# EAGLE design ISI_experiement (EAGLE 7.2.0)
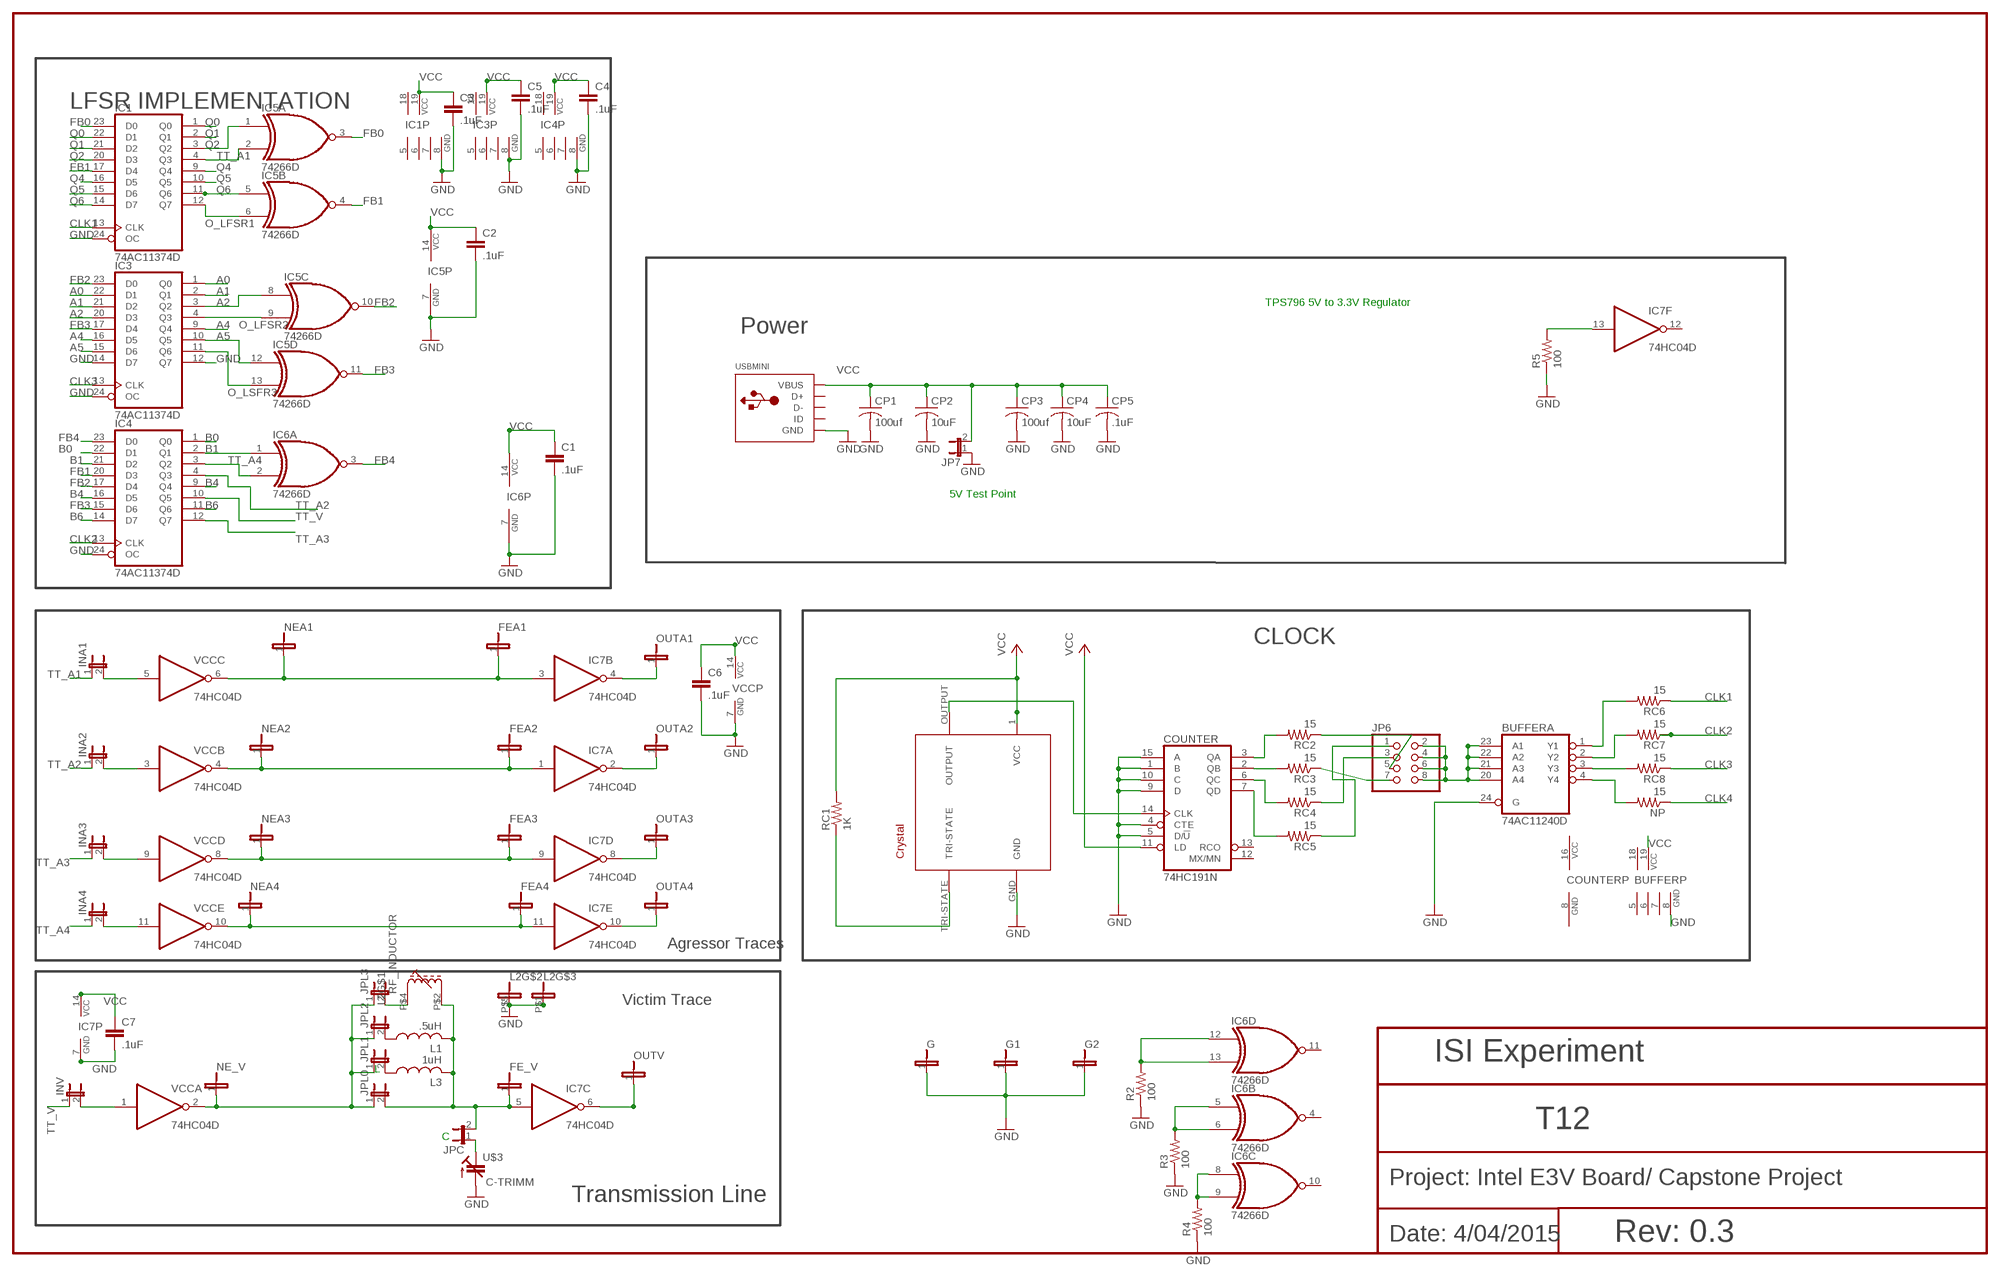
[diagram p0: schematic, sheet 1]

## Parts
BUFFER  74AC11240D  [SO24W]
C1  .1uF  C  [C0805]
C2  .1uF  C  [C0805]
C3  .1uF  C  [C0805]
C4  .1uF  C  [C0805]
C5  .1uF  C  [C0805]
C6  .1uF  C  [C0805]
C7  .1uF  C  [C0805]
COUNTER  74HC191N  [DIL16]
CP1  100uf  C-USC1206K  [C1206K]
CP2  10uF  C-USC1206K  [C1206K]
CP3  100uf  C-USC1206K  [C1206K]
CP4  10uF  C-USC1206K  [C1206K]
CP5  .1uF  C-USC1206K  [C1206K]
FE_V  JP1  [JP1]
FEA1  JP1  [JP1]
FEA2  JP1  [JP1]
FEA3  JP1  [JP1]
FEA4  JP1  [JP1]
G  JP1  [JP1]
G1  JP1  [JP1]
G2  JP1  [JP1]
IC1  74AC11374D  [SO24W]
IC3  74AC11374D  [SO24W]
IC4  74AC11374D  [SO24W]
IC5  74266D  [SO14]
IC6  74266D  [SO14]
IC7  74HC04D  [SO14]
INA1  JP1E  [JP1]
INA2  JP1E  [JP1]
INA3  JP1E  [JP1]
INA4  JP1E  [JP1]
INV  JP1E  [JP1]
JP6  PINHD-2X4  [2X04]
JP7  JP1E  [JP1]
JPC  JP1E  [JP1]
JPL0  JP1E  [JP1]
JPL1  JP1E  [JP1]
JPL2  JP1E  [JP1]
JPL3  JP1E  [JP1]
L1  .5uH  L-USL1812  [L1812]
L2  RF_INDUCTOR  [ADJ_IND_NON_STD_PKG]
L3  1uH  L-USL1812  [L1812]
NE_V  JP1  [JP1]
NEA1  JP1  [JP1]
NEA2  JP1  [JP1]
NEA3  JP1  [JP1]
NEA4  JP1  [JP1]
NP  15  R-US_R0805  [R0805]
OUTA1  JP1  [JP1]
OUTA2  JP1  [JP1]
OUTA3  JP1  [JP1]
OUTA4  JP1  [JP1]
OUTV  JP1  [JP1]
R2  100  R-US_M0805  [M0805]
R3  100  R-US_M0805  [M0805]
R4  100  R-US_M0805  [M0805]
R5  100  R-US_M0805  [M0805]
RC1  1K  R-US_R0805  [R0805]
RC2  15  R-US_R0805  [R0805]
RC3  15  R-US_R0805  [R0805]
RC4  15  R-US_R0805  [R0805]
RC5  15  R-US_R0805  [R0805]
RC6  15  R-US_R0805  [R0805]
RC7  15  R-US_R0805  [R0805]
RC8  15  R-US_R0805  [R0805]
U$1  ECS-8FX  [ECS-8FX]
U$3  C-TRIMM  [C_TRIM]
USBMINI  USBMINIB  [USB-MINIB]
VCC  74HC04D  [SO14]

## Nets
1: FEA1.1 IC7.3(B:I) NEA1.1 VCC.6(C:O)
2: FEA2.1 IC7.1(A:I) NEA2.1 VCC.4(B:O)
3: FEA3.1 IC7.9(D:I) NEA3.1 VCC.8(D:O)
8: FEA4.1 IC7.11(E:I) NEA4.1 VCC.10(E:O)
A0: IC3.1(Q0) IC3.22(D1)
A1: IC3.2(Q1) IC3.21(D2)
A2: IC3.3(Q2) IC3.20(D3) IC5.8(C:I0)
A4: IC3.9(Q4) IC3.16(D5)
A5: IC3.10(Q5) IC3.15(D6) IC5.12(D:I0)
B0: IC4.1(Q0) IC4.22(D1)
B1: IC4.2(Q1) IC4.21(D2) IC6.1(A:I0)
B4: IC4.9(Q4) IC4.16(D5)
B6: IC4.11(Q6) IC4.14(D7)
CLK1: IC1.13(CLK) RC6.1
CLK2: IC4.13(CLK) RC7.1
CLK3: IC3.13(CLK) RC8.1
CLK4: NP.1
CRY_OUT: COUNTER.14(CLK) U$1.OUTPUT
FB0: IC1.23(D0) IC5.3(A:O)
FB1: IC1.17(D4) IC4.20(D3) IC5.4(B:O)
FB2: IC3.23(D0) IC4.17(D4) IC5.10(C:O)
FB3: IC3.17(D4) IC4.15(D6) IC5.11(D:O)
FB4: IC4.23(D0) IC6.3(A:O)
GND: BUFFER.8(P:GND) BUFFER.24(A:G) C1.2 C2.2 C3.2 C4.2 C5.2 C6.2 C7.2 COUNTER.1(B) COUNTER.4(CTE) COUNTER.5(D/!U) COUNTER.9(D) COUNTER.10(C) COUNTER.15(A) CP1.2 CP2.2 CP3.2 CP4.2 CP5.2 G1.1 G2.1 G.1 IC1.8(GND) IC1.24(OC) IC3.8(GND) IC3.12(Q7) IC3.14(D7) IC3.24(OC) IC4.8(GND) IC4.24(OC) IC5.7(P:GND) IC6.7(P:GND) IC7.7(P:GND) JP7.1 L2.P$1 L2.P$5 R2.1 R3.1 R4.1 R5.1 U$1.GND U$3.-(G) USBMINI.GND VCC.7(P:GND)
N$2: INA2.2 VCC.3(B:I)
N$3: JPL3.2 L2.P$4(A1)
N$4: FE_V.1 IC7.5(C:I) JPC.2 JPL0.2 L1.2 L2.P$2(E1) L3.2
N$5: RC1.1 U$1.TRI-STATE
N$7: COUNTER.7(QD) RC5.2
N$8: JPC.1 U$3.+(P)
N$13: IC7.4(B:O) OUTA1.1
N$14: INA1.2 VCC.5(C:I)
N$15: COUNTER.3(QA) RC2.2
N$16: IC6.12(D:I0) IC6.13(D:I1) R2.2
N$17: IC7.6(C:O) OUTV.1
N$18: JPL2.2 L1.1
N$19: IC7.10(E:O) OUTA4.1
N$20: IC7.2(A:O) OUTA2.1
N$21: INA4.2 VCC.11(E:I)
N$22: INV.2 VCC.1(A:I)
N$23: COUNTER.2(QB) RC3.2
N$24: JPL1.2 L3.1
N$25: INA3.2 VCC.9(D:I)
N$26: COUNTER.6(QC) RC4.2
N$27: IC6.5(B:I0) IC6.6(B:I1) R3.2
N$28: JP6.5 RC2.1
N$29: JP6.3 RC4.1
N$30: JP6.7 RC3.1
N$31: JP6.1 RC5.1
N$32: BUFFER.20(A:A4) BUFFER.21(A:A3) BUFFER.22(A:A2) BUFFER.23(A:A1) JP6.2 JP6.4 JP6.6 JP6.8
N$33: BUFFER.1(A:Y1) RC6.2
N$34: BUFFER.2(A:Y2) RC7.2
N$35: BUFFER.3(A:Y3) RC8.2
N$36: BUFFER.4(A:Y4) NP.2
N$37: IC6.8(C:I0) IC6.9(C:I1) R4.2
N$41: IC7.13(F:I) R5.2
O_LFSR1: IC1.12(Q7) IC5.6(B:I1)
O_LFSR2: IC3.4(Q3) IC5.9(C:I1)
O_LSFR3: IC3.11(Q6) IC5.13(D:I1)
OUTA4: IC7.8(D:O) OUTA3.1
Q0: IC1.1(Q0) IC1.22(D1)
Q1: IC1.2(Q1) IC1.21(D2)
Q2: IC1.3(Q2) IC1.20(D3) IC5.1(A:I0)
Q4: IC1.9(Q4) IC1.16(D5)
Q5: IC1.10(Q5) IC1.15(D6)
Q6: IC1.11(Q6) IC1.14(D7) IC5.5(B:I0)
TT_A1: IC1.4(Q3) IC5.2(A:I1) INA1.1
TT_A2: IC4.4(Q3) INA2.1
TT_A3: IC4.12(Q7) INA3.1
TT_A4: IC4.3(Q2) IC6.2(A:I1) INA4.1
TT_V: IC4.10(Q5) INV.1
V1: JPL0.1 JPL1.1 JPL2.1 JPL3.1 NE_V.1 VCC.2(A:O)
VCC: BUFFER.19(P:VCC) C1.1 C2.1 C3.1 C4.1 C5.1 C6.1 C7.1 COUNTER.11(LD) CP1.1 CP2.1 CP3.1 CP4.1 CP5.1 IC1.19(VCC) IC3.19(VCC) IC4.19(VCC) IC5.14(P:VCC) IC6.14(P:VCC) IC7.14(P:VCC) JP7.2 RC1.2 U$1.1(VCC) USBMINI.VBUS VCC.14(P:VCC)
Unconnected: BUFFER.9(B:Y1) BUFFER.10(B:Y2) BUFFER.11(B:Y3) BUFFER.12(B:Y4) BUFFER.13(B:G) BUFFER.14(B:A4) BUFFER.15(B:A3) BUFFER.16(B:A2) BUFFER.17(B:A1) COUNTER.12(MX/MN) COUNTER.13(RCO) IC6.4(B:O) IC6.10(C:O) IC6.11(D:O) IC7.12(F:O) USBMINI.D+ USBMINI.D- USBMINI.ID VCC.12(F:O) VCC.13(F:I)

## Notes on the sheet
- LFSR IMPLEMENTATION
- TPS796 5V to 3.3V Regulator
- Power
- 5V Test Point
- CLOCK
- Agressor Traces
- Victim Trace
- ISI Experiment
- L
- T12
- C
- Project: Intel E3V Board/ Capstone Project
- Transmission Line
- Date: 4/04/2015 | Rev: 0.3

## Power pins joined to a net without a drawn wire
GND: BUFFER.5(P:GND) BUFFER.6(P:GND) BUFFER.7(P:GND) COUNTER.8(GND) IC1.5(GND) IC1.6(GND) IC1.7(GND) IC3.5(GND) IC3.6(GND) IC3.7(GND) IC4.5(GND) IC4.6(GND) IC4.7(GND)
VCC: BUFFER.18(P:VCC) COUNTER.16(VCC) IC1.18(VCC) IC3.18(VCC) IC4.18(VCC)

## Library data of the parts
BUFFER = 74ac-logic:74AC11240: Octal BUFFER/DRIVER
C1-C7 = T06_LockBox:C: CAPACITOR, European symbol; SPICEMODEL: NONE; SPICEPREFIX: C
COUNTER = 74xx-eu:74*191: Synchronous UP/DOWN COUNTER
CP1-CP5 = adafruit:C-US: CAPACITOR, American symbol
FE_V FEA1-FEA4 G G1 G2 NE_V NEA1-NEA4 OUTA1-OUTA4 OUTV = E3VB_ISI:JP1
IC1 IC3 IC4 = 74ac-logic:74AC11374: Octal D-type edge triggered FLIP FLOP, 3-state
IC5 IC6 = 74xx-us:74*266: Quadruple EXCLUSIVE-NOR (XNOR), open-collector
IC7 VCC = 74xx-eu:74*04: Hex INVERTER
INA1-INA4 INV JP7 JPC JPL0 JPL1-JPL3 = jumper:JP1E: JUMPER
JP6 = adafruit:PINHD-2X4: PIN HEADER
L1 L3 = rcl:L-US: INDUCTOR, American symbol
L2 = E3VB_ISI:RF_INDUCTOR
NP RC1-RC8 = adafruit:R-US_: RESISTOR, American symbol
R2-R5 = T06_LockBox:R-US_: RESISTOR, American symbol
U$1 = Capstone:ECS-8FX: SMD Clock Oscillator
U$3 = E3VB_ISI:C-TRIMM: Variable capacitor Based on spague Goodman 7mm non magnetic GSX366NM
USBMINI = adafruit:USB: USB Connectors USBMINIB - Surface Mount Female Mini-B USB Connector 4UConnector: 06564 By microbuilder.eu Thru-hole RA Female Mini-B USB Connector 4UConnector: 18732 By ladyada.net

## Board
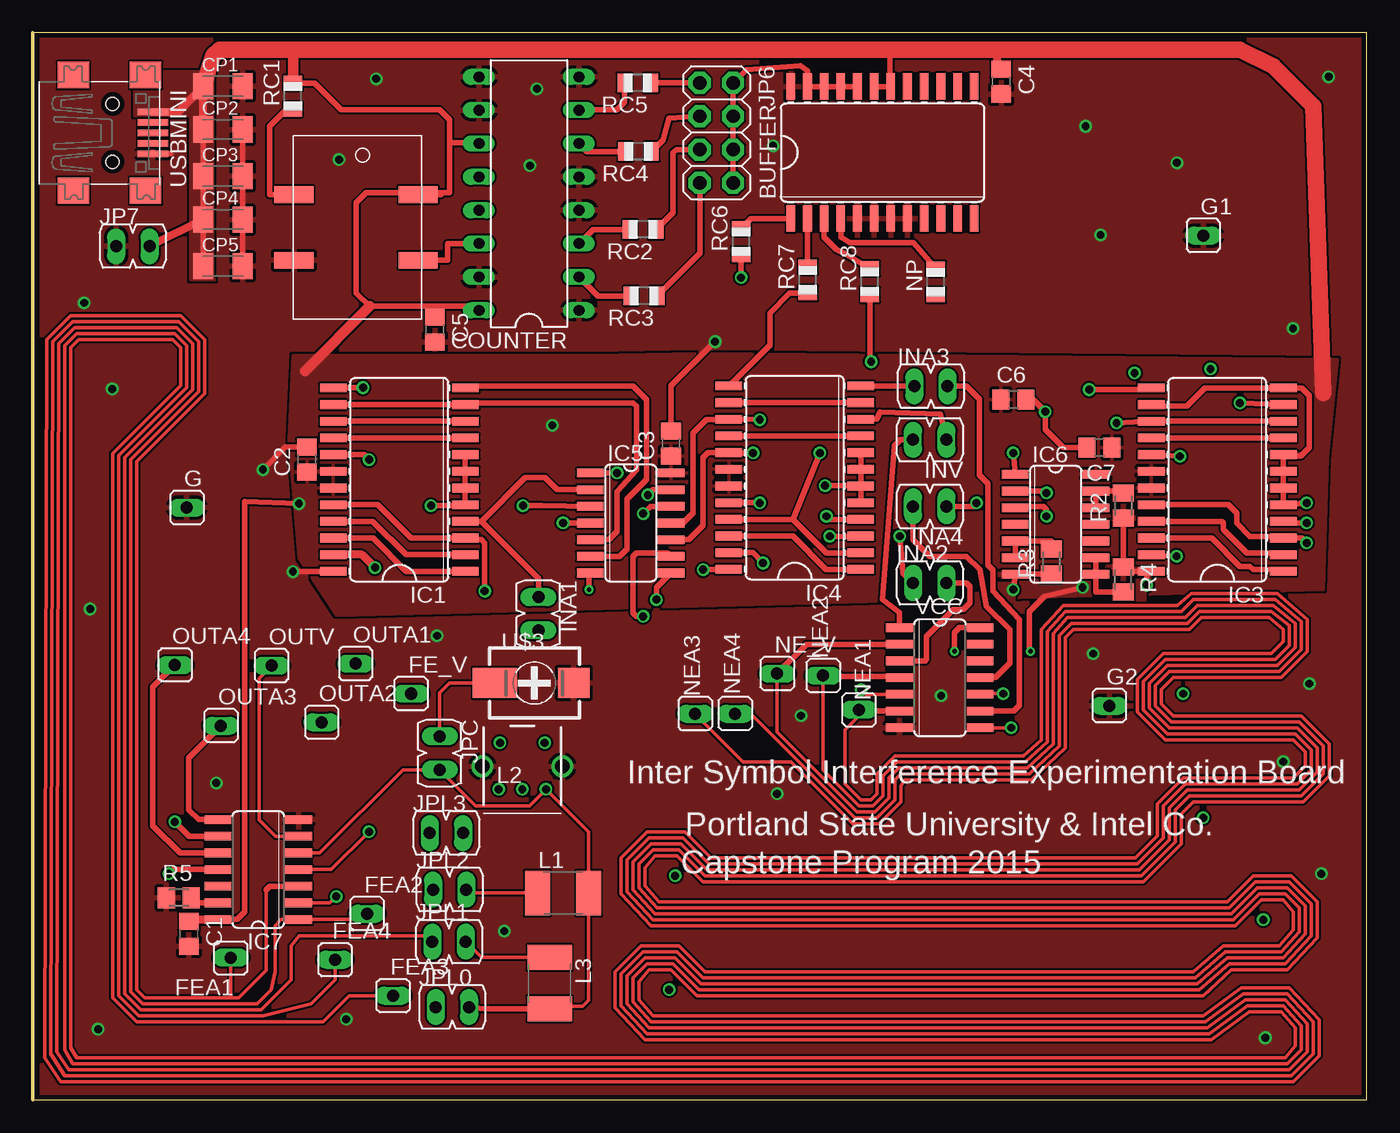
[diagram p1: board, top side]
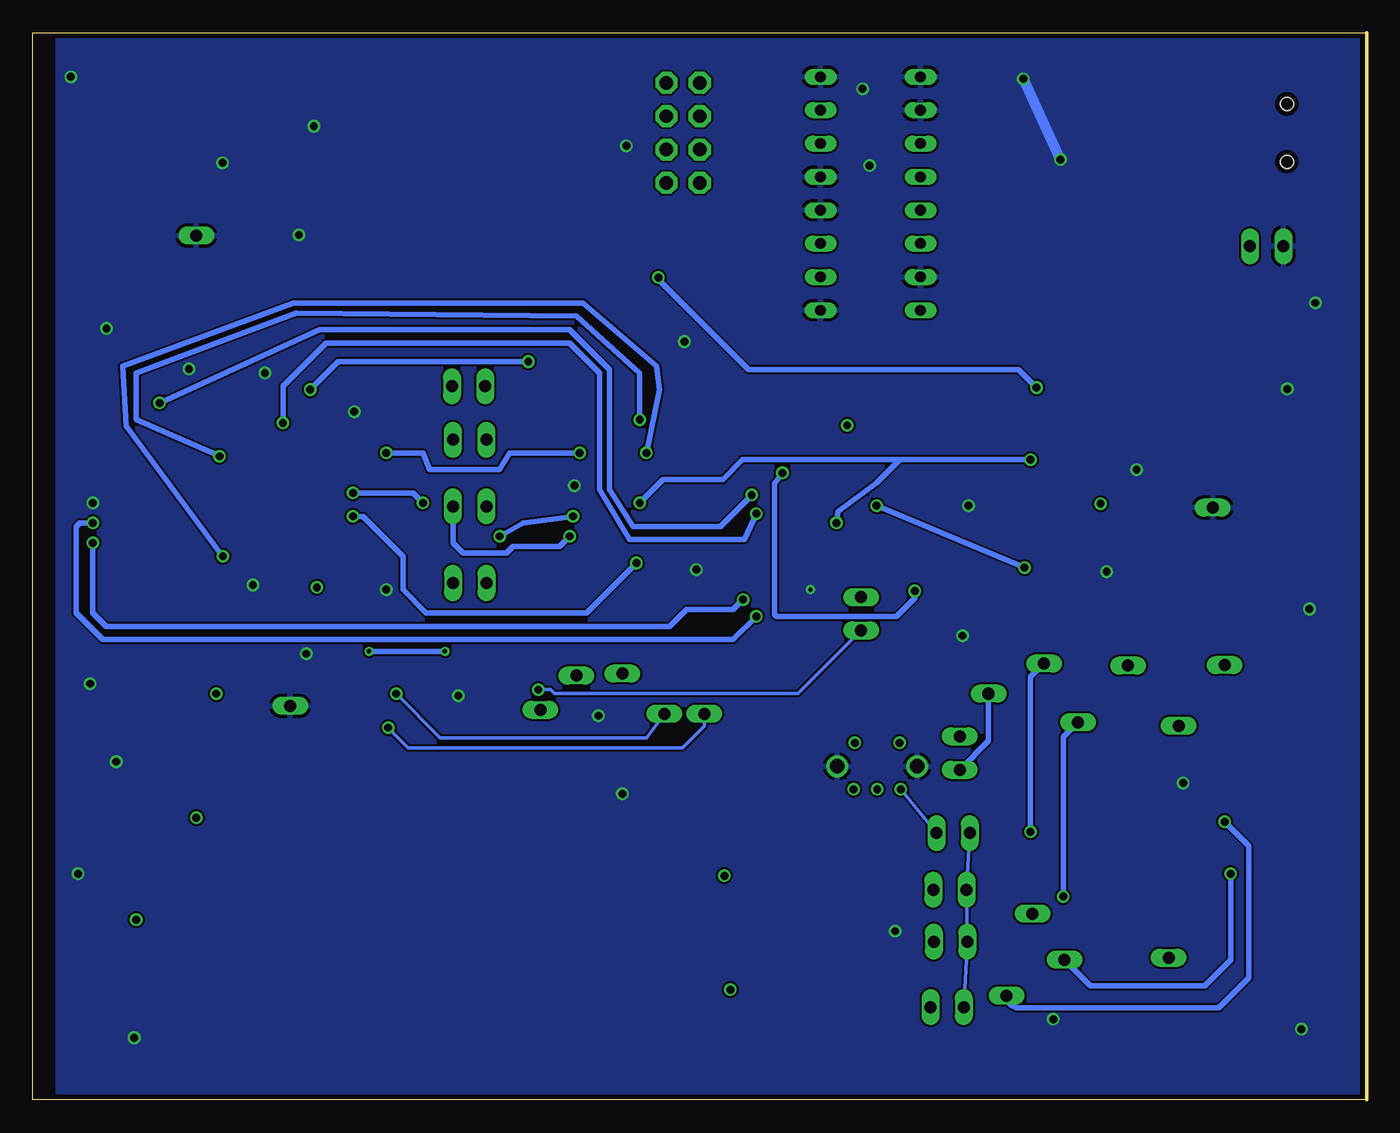
[diagram p2: board, bottom side, seen from below]

Size 101.6 x 81.28 mm. Coordinates in mm from the lower left corner, seen from the top.
Outline: 0,0 101.6,0 101.6,81.28 0,81.28 0,0
Copper layers (1*16): Top 0.0356mm / dielectric 1.5011mm / Bottom 0.0356mm
Design rules "oshpark-2layer": minimum track width 6mil, minimum drill 13mil, track to track 6mil, track to pad 6mil, pad to pad 6mil, via to via 6mil, smd to smd 6mil, copper to edge 15mil, drill to drill 6mil, minimum pad ring 7mil, minimum via ring 7mil, stop-mask expansion 4mil, vias tented up to drill 0mil, thermal gap 10mil

### Footprints (pad centres in the part's own frame; a part is rotated, then mirrored left to right if it is on the bottom)
SO24W = smd 0.66 x 2.032: 1 -6.985,-5.029; 2 -5.715,-5.029; 3 -4.445,-5.029; 4 -3.175,-5.029; 5 -1.905,-5.029; 6 -0.635,-5.029; 7 0.635,-5.029; 8 1.905,-5.029; 9 3.175,-5.029; 10 4.445,-5.029; 11 5.715,-5.029; 12 6.985,-5.029; 13 6.985,5.029; 14 5.715,5.029; 15 4.445,5.029; 16 3.175,5.029; 17 1.905,5.029; 18 0.635,5.029; 19 -0.635,5.029; 20 -1.905,5.029; 21 -3.175,5.029; 22 -4.445,5.029; 23 -5.715,5.029; 24 -6.985,5.029
C0805 = smd 1.3 x 1.5: 1 -0.95,0; 2 0.95,0
DIL16 = drill 0.813 long: 1 -8.89,-3.81; 2 -6.35,-3.81; 3 -3.81,-3.81; 4 -1.27,-3.81; 5 1.27,-3.81; 6 3.81,-3.81; 7 6.35,-3.81; 8 8.89,-3.81; 9 8.89,3.81; 10 6.35,3.81; 11 3.81,3.81; 12 1.27,3.81; 13 -1.27,3.81; 14 -3.81,3.81; 15 -6.35,3.81; 16 -8.89,3.81
C1206K = smd 1.5 x 2: 1 -1.5,0; 2 1.5,0
JP1 = drill 0.914 long: 1 0,0
SO14 = smd 0.66 x 2.032: 1 -3.81,-3.073; 2 -2.54,-3.073; 3 -1.27,-3.073; 4 0,-3.073; 5 1.27,-3.073; 6 2.54,-3.073; 7 3.81,-3.073; 8 3.81,3.073; 9 2.54,3.073; 10 1.27,3.073; 11 0,3.073; 12 -1.27,3.073; 13 -2.54,3.073; 14 -3.81,3.073
JP1' = drill 0.914 long: 1 0,-1.27; 2 0,1.27
2X04 = drill 1.016 pad 1.676 octagon: 1 -3.81,-1.27; 2 -3.81,1.27; 3 -1.27,-1.27; 4 -1.27,1.27; 5 1.27,-1.27; 6 1.27,1.27; 7 3.81,-1.27; 8 3.81,1.27
L1812 = smd 1.9 x 3.4: 1 -1.95,0; 2 1.95,0
ADJ_IND_NON_STD_PKG = drill 1.1: P$1 3.048,0; P$5 -3.048,0 | drill 0.6: P$2 -1.8,1.75; P$3 0,1.75; P$4 1.8,1.75; P$6 -1.7,-1.8; P$7 1.7,-1.8
R0805 = smd 1.1 x 1.4: 1 -1,0; 2 1,0
M0805 = smd 1.3 x 1.6: 1 -0.95,0; 2 0.95,0
ECS-8FX = smd 1.27 x 3: 1 4.5,-0.27; GND 9.5,-9.73; OUTPUT 9.5,-0.27; TRI-STATE 4.5,-9.73
C_TRIM = smd 3.4 x 2.3: + -3,0 | smd 2.4 x 2.3: - 3,0
USB-MINIB = smd 0.5 x 2.308: D+ 0,4.064; D- -0.8,4.064; GND 1.6,4.064; ID 0.8,4.064; VBUS -1.6,4.064 | smd 2 x 2.4: GND1 -4.4,-2; GND2 -4.4,3.5; GND3 4.4,3.5; GND4 4.4,-2 | hole 1: -2.2,1; 2.2,1

### Placement (x,y rotation side)
BUFFER  64.72,72.16 0 top
C1  11.89,12.65 270 top
C2  20.88,48.77 90 top
C3  48.62,49.99 90 top
C4  73.76,77.57 270 top
C5  30.63,58.67 270 top
C6  74.68,53.34 0 top
C7  81.23,49.68 180 top
COUNTER  37.8,69.04 90 top
CP1  14.48,77.22 0 top
CP2  14.48,73.91 0 top
CP3  14.48,70.36 0 top
CP4  14.48,67.06 0 top
CP5  14.48,63.5 0 top
FE_V  28.8,30.94 0 top
FEA1  15.09,10.82 180 top
FEA2  25.45,14.17 0 top
FEA3  27.43,7.92 0 top
FEA4  23.01,10.67 0 top
G  11.73,45.11 0 top
G1  89.15,65.84 0 top
G2  81.99,30.02 0 top
IC1  27.91,47.24 90 top
IC3  90.22,47.24 90 top
IC4  58.04,47.4 90 top
IC5  45.54,43.94 270 top
IC6  77.9,43.84 270 top
IC7  17.18,17.54 90 top
INA1  [JP1']  38.51,37.03 180 top
INA2  [JP1']  68.33,39.37 270 top
INA3  [JP1']  68.41,54.36 270 top
INA4  [JP1']  68.33,45.21 90 top
INV  [JP1']  68.33,50.29 90 top
JP6  52.07,73.66 270 top
JP7  [JP1']  7.62,65.02 270 top
JPC  [JP1']  30.99,26.42 180 top
JPL0  [JP1']  31.95,7.06 270 top
JPL1  [JP1']  31.7,12.04 270 top
JPL2  [JP1']  31.75,16 270 top
JPL3  [JP1']  31.5,20.32 270 top
L1  40.39,15.75 0 top
L2  37.29,25.4 180 top
L3  39.37,8.89 270 top
NE_V  56.69,32.46 0 top
NEA1  62.94,29.72 180 top
NEA2  60.2,32.31 0 top
NEA3  50.44,29.41 0 top
NEA4  53.49,29.41 0 top
NP  68.78,62.31 90 top
OUTA1  24.59,33.22 0 top
OUTA2  22,28.75 0 top
OUTA3  14.33,28.5 0 top
OUTA4  10.82,33.12 0 top
OUTV  18.19,33.07 0 top
R2  83.06,45.26 90 top
R3  77.57,41 90 top
R4  83.06,39.62 270 top
R5  11.13,15.39 0 top
RC1  19.81,76.45 90 top
RC2  46.48,66.29 180 top
RC3  46.56,61.24 180 top
RC4  46.13,72.24 180 top
RC5  46.08,77.47 180 top
RC6  53.95,65.38 90 top
RC7  59.03,62.46 90 top
RC8  63.75,62.33 90 top
U$1  29.62,73.46 270 top
U$3  38.2,31.75 0 top
USBMINI  5.08,73.66 270 top
VCC  69.09,32.16 270 top

### Tracks (layer width: path | path; a pad name or v marks a point on that pad's centre or on a via)
1
  Top 0.254: 15.09,7.77 15.7,7.77 17.78,9.86 17.78,16 | 15.09,7.77 8.53,7.77 7.92,8.38 7.92,48.62 13.11,53.8 13.11,57.91 11.28,59.74 2.9,59.74 1.07,57.91 0.91,3.2 2.13,1.37 96.01,1.37 97.99,3.35 97.99,6.1 95.71,8.53 92.05,8.53 89.15,6.4 47.24,6.4 46.18,7.62 46.18,8.99 46.94,9.91 48.62,9.91 50.6,7.92 89.15,7.92 91.29,9.91 95.56,9.91 97.84,12.34 97.84,15.09 95.86,17.07 92.96,17.07 90.98,15.09 47.7,15.09 46.63,16.31 46.63,17.68 47.4,18.59 49.07,18.59 51.05,16.61 84.58,16.61 87.48,19.51 87.48,21.79 88.39,22.71 96.77,22.71 98.75,24.69 98.75,27.13 96.62,29.26 86.87,29.26 85.95,30.18 85.95,31.24 86.87,32.16 95.1,32.16 97.08,34.14 97.08,36.58 94.79,38.56 88.24,38.56 87.17,37.64 78.49,37.64 76.81,35.81 76.81,27.43 75.44,26.21 65.68,26.21 64.31,24.84 64.31,23.32 63.86,22.86 63.09,22.86 61.87,24.08 61.87,28.19 62.94,29.26 NEA1.1 | FEA1.1 15.09,7.77
  Top 0.406: 66.04,29.64 66.04,29.72 65.79,29.62 | IC7.3 20.23,16.26 18.03,16.26 17.78,16 | VCC.6 65.79,29.62 | 65.79,29.62 63.04,29.62 NEA1.1
2
  Top 0.254: NEA2.1 60.2,25.15 62.94,22.4 64.01,22.4 64.77,23.16 64.77,24.69 65.84,25.76 75.59,25.76 77.27,27.28 77.27,35.66 78.64,37.19 87.48,37.19 88.39,38.1 94.64,38.1 96.62,36.42 96.62,34.29 94.94,32.61 86.56,32.61 85.5,31.55 85.5,30.02 86.72,28.8 96.47,28.8 98.3,26.98 98.3,24.84 96.62,23.16 88.09,23.16 87.02,22.1 87.02,19.66 84.43,17.07 51.21,17.07 49.23,19.05 47.24,19.05 46.18,17.98 46.18,16.15 47.55,14.63 91.14,14.63 93.12,16.61 95.71,16.61 97.38,14.94 97.38,12.5 95.4,10.36 91.14,10.36 88.85,8.38 50.75,8.38 48.77,10.36 46.79,10.36 45.72,9.3 45.72,7.47 47.09,5.94 89.31,5.94 92.2,8.08 95.56,8.08 97.54,5.94 97.54,3.5 95.86,1.83 2.44,1.83 1.37,3.5 1.52,57.76 3.05,59.28 11.12,59.28 12.65,57.76 12.65,53.95 7.47,48.77 7.47,8.23 8.38,7.32 17.07,7.32 18.14,8.38 18.44,9.75 18.44,13.26 18.91,13.73 IC7.1 25.01,13.73 FEA2.1
  Top 0.406: VCC.4 65.91,32.26 60.25,32.26 NEA2.1 | IC7.1 20.23,13.72
3  (via drill 0.6)
  Top 0.254: NEA3.1 54.1,25.76 57.76,25.76 62.48,21.03 64.47,21.03 66.14,22.71 66.14,23.93 66.45,24.38 76.05,24.38 78.64,26.82 78.64,35.2 79.25,35.81 88.09,35.81 89,36.73 94.18,36.73 95.25,35.81 95.25,34.9 94.34,33.98 86.11,33.98 84.12,32 84.12,29.57 86.26,27.43 96.01,27.43 96.93,26.52 96.93,25.45 96.01,24.54 87.63,24.54 85.65,22.55 85.65,20.12 83.97,18.44 51.66,18.44 49.68,20.42 46.79,20.42 44.81,18.44 44.81,15.7 47.09,13.26 91.59,13.26 93.57,15.24 95.25,15.24 96.01,14.33 96.01,12.95 94.94,11.73 90.68,11.73 88.39,9.75 51.21,9.75 49.23,11.73 46.33,11.73 44.35,9.75 44.35,7.01 46.63,4.57 89.76,4.57 92.66,6.71 95.1,6.71 96.16,5.49 96.16,4.12 95.4,3.2 3.35,3.2 2.9,3.96 2.9,57.3 3.5,57.91 10.67,57.91 11.28,57.3 11.28,54.41 6.1,49.23 6.1,7.77 7.92,5.94 22.1,5.94 24.08,7.92 FEA3.1 | VCC.8 v74.52,28.35
  Top 0.406: VCC.8 72.26,28.45 | IC7.9 11.92,20.08 v10.82,21.18
  Bottom 0.254: v74.52,28.35 73,26.82 52.12,26.82 50.44,28.5 NEA3.1
  Bottom 0.406: v10.82,21.18 8.99,19.36 8.99,9.3 11.28,7.01 26.52,7.01 arc90 FEA3.1
8  (via drill 0.6)
  Top 0.254: NEA4.1 54.71,29.41 62.64,21.49 64.31,21.49 65.68,22.86 65.68,24.38 66.14,24.84 75.89,24.84 78.18,26.98 78.18,35.36 79.1,36.27 87.94,36.27 88.85,37.19 94.34,37.19 95.71,36.12 95.71,34.59 94.64,33.53 86.26,33.53 84.58,31.85 84.58,29.72 86.41,27.89 96.16,27.89 97.38,26.67 97.38,25.15 96.32,24.08 87.78,24.08 86.11,22.4 86.11,19.96 84.12,17.98 51.51,17.98 49.53,19.96 46.94,19.96 45.26,18.29 45.26,15.85 47.24,13.72 91.44,13.72 93.42,15.7 95.4,15.7 96.47,14.63 96.47,12.8 95.1,11.28 90.83,11.28 88.54,9.3 51.05,9.3 49.07,11.28 46.48,11.28 44.81,9.6 44.81,7.16 46.79,5.03 89.61,5.03 92.51,7.16 95.25,7.16 96.62,5.64 96.62,3.81 95.56,2.74 3.05,2.74 2.44,3.81 2.44,57.45 3.35,58.37 10.82,58.37 11.73,57.45 11.73,54.25 6.55,49.07 6.55,7.92 8.08,6.4 17.53,6.4 21.18,7.32 23.01,9.14 FEA4.1 | VCC.10 72.16,30.94 v73.91,30.94
  Top 0.406: IC7.11 10.68,17.54 v10.36,17.22
  Bottom 0.254: v73.91,30.94 70.56,27.58 54.86,27.58 NEA4.1
  Bottom 0.406: v10.36,17.22 10.36,10.67 12.34,8.69 21.03,8.69 FEA4.1
A0
  Top 0.406: IC3.22 89.79,42.8 91.95,40.64 92.71,40.64 92.96,40.39 94.82,40.39 IC3.1
A1
  Top 0.406: IC3.21 90.55,44.07 90.68,43.94 90.68,43.43 92.46,41.66 94.82,41.66 IC3.2
A2  (via drill 0.6)
  Top 0.406: IC3.20 91.06,45.34 91.69,44.7 91.69,43.94 92.71,42.93 94.82,42.93 IC3.3 96.65,42.8 v97.03,42.42 | IC5.8 47.5,39.01 v47.5,38.1
  Bottom 0.406: v47.5,38.1 48.26,37.34 51.82,37.34 53.09,36.07 96.01,36.07 97.03,37.08 v97.03,42.42
A4
  Top 0.406: IC3.9 IC3.16
A5  (via drill 0.6)
  Top 0.406: IC3.10 IC3.15 v82.55,51.56 | IC5.12 47.04,45.21 v46.48,44.65
  Bottom 0.406: v46.48,44.65 47.4,42.67 56.13,42.67 58.42,46.48 58.42,55.37 60.71,57.66 79.25,57.66 82.55,54.36 v82.55,51.56
B0
  Top 0.406: IC4.22 57.89,42.95 60.43,40.41 IC4.1
B1  (via drill 0.6)
  Top 0.406: IC4.21 57.89,44.22 | 57.89,44.22 60.45,41.66 63.04,41.66 IC4.2 | v74.68,49.28 IC6.1 | v59.94,49.28 57.89,44.22
  Bottom 0.406: v59.94,49.28 65.28,49.28 66.04,48.01 71.37,48.01 71.88,49.28 v74.68,49.28
B4
  Top 0.406: IC4.16 IC4.9
B6
  Top 0.406: IC4.14 IC4.11
CLK1  (via drill 0.6)
  Top 0.406: 53.46,64.38 RC6.1 v53.95,62.64 | v25.15,54.25 22.91,54.25 IC1.13
  Bottom 0.406: v53.95,62.64 53.95,62.48 47.09,55.63 26.52,55.63 v25.15,54.25
CLK2
  Top 0.406: IC4.13 56.13,57.51 56.13,59.94 57.65,61.46 RC7.1
CLK3  (via drill 0.6)
  Top 0.406: RC8.1 63.75,56.34 v63.86,56.24 | v80.47,54.1 84.76,54.1 IC3.13
  Bottom 0.406: v63.86,56.24 78.33,56.24 v80.47,54.1
CRY_OUT
  Top 0.406: COUNTER.14 31.61,65.23 31.61,63.96 U$1.OUTPUT
FB0  (via drill 0.6)
  Top 0.406: IC1.23 22.76,41.4 | IC5.3 38.76,45.26 v37.34,45.26
  Top 0.61: v26.06,40.54 25.07,41.53 IC1.23
  Bottom 0.406: v26.06,40.54 v37.34,45.26
FB1  (via drill 0.6)
  Top 0.406: IC5.4 v40.39,43.94 | IC4.20 55.35,45.49 v55.37,45.47 | v25.6,48.77 25.22,49.15 IC1.17
  Bottom 0.406: v40.39,43.94 40.28,44.81 37.34,46.99 35.56,48.77 | v55.37,45.47 53.59,47.24 49.02,47.24 47.55,48.77 35.56,48.77 | 35.56,48.77 v25.6,48.77
FB2  (via drill 0.6)
  Top 0.406: v87.12,41.4 IC3.23 | IC5.10 49.99,42.67 51.05,43.74 51.05,48.92 51.44,49.3 IC4.17 53.03,49.28 v54.86,49.28
  Bottom 0.406: v54.86,49.28 53.85,54.1 54.1,55.88 59.69,60.71 81.79,60.71 94.74,55.88 94.49,51.31 v87.12,41.4
FB3  (via drill 0.6)
  Top 0.406: IC5.11 49.53,43.94 50.29,44.7 50.29,50.8 51.31,51.82 52.98,51.82 IC4.15 v55.37,51.82 | IC3.17 v87.38,49.02
  Bottom 0.406: v55.37,51.82 55.37,55.37 60.2,59.69 81.53,59.94 93.73,55.37 93.73,51.82 v87.38,49.02
FB4  (via drill 0.6)
  Top 0.406: v55.63,40.89 54.84,41.68 IC4.23 | IC6.3 74.93,45.21 76.96,45.21 77.22,44.96 v77.22,44.45
  Bottom 0.406: v55.63,40.89 59.44,37.08 71.63,37.08 73.41,38.86 73.41,41.4 76.45,44.45 v77.22,44.45
GND  (via drill 0.33, 0.6)
  Top 0.406: USBMINI.GND 10.49,72.06 | CP5.2 CP4.2 CP3.2 CP2.2 | IC4.6 IC4.5 | 42.42,40.13 IC5.7 42.37,40.03 v42.37,38.86 | IC4.8 IC4.7 IC4.6 | IC3.14 85.01,52.83 87.88,52.83 89.28,54.23 IC3.12 96.65,54.23 97.23,53.65 97.23,49.68 96.57,49.02 95.25,49.02 | 95.25,49.02 95.07,49.02 IC3.8 95.12,49.15 95.25,49.02 | 95.25,49.02 IC3.7 IC3.6 IC3.5 v97.03,45.47 | v74.68,38.86 IC6.7 74.84,40.05 R3.1 | v30.33,45.26 32.87,45.26 IC1.5 IC1.6 IC1.7 IC1.8 | v84.84,39.22 84.84,40.26 IC3.24 83.37,40.26 arc-90 R4.1 R2.1 | IC1.24 22.86,40.23 v19.81,40.23 | IC4.24 52.98,40.39 v51.05,40.39 | IC4.6 63.04,46.79 v60.35,46.79 | C2.2 19.24,49.72 v17.53,48.01 | C3.2 48.62,54.41 v51.97,57.76 | C6.2 76.2,53.34 v77.11,52.43 77.11,51.05 78.49,49.68 C7.2
  Bottom 0.813: v26.16,77.78 v23.32,71.63
  other vias: 3.91,60.71 38.4,77.01 37.87,71.17 56.39,72.67 80.19,74.17 81.33,65.89 87.15,71.37 95.99,58.75 80.77,33.99 98.15,17.22 97.23,31.7 98.7,77.93 6.05,54.15 4.37,37.39 4.98,5.38 23.88,6.15 35.92,12.85 95.25,25.76 93.88,4.72 30.78,35.36 89.71,55.68 83.92,55.37 56.69,23.32 58.52,29.26 69.19,30.78 13.97,24.13
  pour Top (rank 2): -0.61,83.52 103.17,82.91 101.65,-2.29 -0.76,-2.13 -2.44,-0.46
  pour Bottom: 99.67,-0.15 0,0 0,81.28 99.67,81.69
GND1  (via drill 0.6)
  other vias: 48.46,8.38
GND2  (via drill 0.6)
  other vias: 93.73,13.72
GND3  (via drill 0.6)
  other vias: 48.92,17.07
GND4  (via drill 0.6)
  other vias: 87.63,30.94
GND5  (via drill 0.6)
  other vias: 89.15,21.49
N$2
  Top 0.406: INA2.2 71.12,39.37 71.37,39.12 71.37,37.85 70.87,37.34 70.1,37.34 68.07,35.31 68.07,33.53 67.97,33.43 VCC.3
N$3
  Bottom 0.254: L2.P$4 JPL3.2
N$4
  Top 0.254: 20.27,18.8 21.84,18.8 28.19,25.15 JPC.2 33.73,22.4 37.84,22.4 L2.P$2 42.34,20.4 L1.2 42.34,7.59 41.86,7.11 39.54,7.11
  Top 0.406: IC7.5 20.27,18.8 | JPL0.2 34.46,6.94 L3.2 39.54,7.11
  Bottom 0.406: FE_V.1 28.8,27.33 JPC.2
N$5
  Top 0.406: RC1.1 19.32,75.45 18.03,74.17 18.03,69.65 18.03,69.51 18.03,68.96 U$1.TRI-STATE
N$7
  Top 0.406: RC5.2 45.08,76.01 44.5,75.44 41.66,75.44 COUNTER.7
N$8
  Top 0.254: U$3.+ 31.75,31.75 30.99,30.99 JPC.1
N$13  (via drill 0.6)
  Top 0.254: v25.6,20.42 22.72,17.54 IC7.4
  Bottom 0.406: OUTA1.1 25.6,32.21 v25.6,20.42
N$14  (via drill 0.6)
  Top 0.254: v63.09,31.24 63.45,30.89 VCC.5
  Top 0.406: 65.91,30.79 VCC.5
  Bottom 0.254: INA1.2 43.33,30.94 61.87,30.94 62.18,31.24 v63.09,31.24
N$15
  Top 0.406: COUNTER.3 42.67,66.29 RC2.2
N$16
  Top 0.406: R2.2 arc90 82.89,46.38 IC6.13 IC6.12
N$17
  Top 0.254: 20.23,20.07 18.49,20.07 17.22,21.34 17.22,32.11 OUTV.1
  Top 0.406: IC7.6 20.23,20.07
N$18
  Top 0.254: JPL2.2 33.27,15.75 L1.1
N$19
  Top 0.406: 14.12,18.8 IC7.10 11.21,18.81 9.14,20.88 9.14,31.45 OUTA4.1
N$20  (via drill 0.6)
  Top 0.254: 20.27,14.99 22.61,14.99 v23.11,15.49
  Top 0.406: IC7.2 20.27,14.99
  Bottom 0.406: v23.11,15.49 23.11,27.64 OUTA2.1
N$21
  Top 0.406: INA4.2 67.06,42.67 68.33,41.4 71.12,41.4 72.14,40.39 72.64,37.59 74.42,35.81 74.42,33.27 73.3,32.16 VCC.11
N$22
  Top 0.406: VCC.1 66.02,37.11 64.72,38.1 65.63,49.84 66.09,50.29 INV.2
N$23
  Top 0.406: COUNTER.2 43.05,61.24 RC3.2
N$24
  Top 0.254: JPL1.2 34.17,10.84 L3.1
N$25
  Top 0.406: INA3.2 71.12,54.36 72.08,53.39 72.08,47.6 72.75,46.94 72.75,40.74 73.13,40.36 73.13,38.76 75.16,36.58 75.16,30.05 74.73,29.62 VCC.9
N$26
  Top 0.406: COUNTER.6 42.22,72.24 RC4.2
N$27
  Top 0.406: R3.2 77.57,42.57 IC6.5 IC6.6
N$28
  Top 0.406: RC2.1 48.77,67.58 48.77,72.14 49.02,72.39 JP6.5
N$29
  Top 0.406: RC4.1 48.01,73.12 48.46,74.78 JP6.3
N$30
  Top 0.406: RC3.1 50.8,64.48 JP6.7
N$31
  Top 0.406: RC5.1 JP6.1 51.31,77.47
N$32
  Top 0.406: JP6.8 JP6.6 JP6.4 JP6.2 54.36,78.49 58.47,78.79 59,78.41 BUFFER.23 BUFFER.22 BUFFER.21 BUFFER.20
N$33
  Top 0.406: RC6.2 54.7,67.13 BUFFER.1
N$34
  Top 0.406: RC7.2 59,63.48 BUFFER.2
N$35
  Top 0.406: RC8.2 61.86,64.47 61.21,64.77 60.27,65.71 BUFFER.3
N$36
  Top 0.406: NP.2 67.06,65.28 62.23,65.28 61.54,65.71 BUFFER.4
N$37
  Top 0.406: 80.97,40.2 IC6.8 | IC6.9 IC6.8 | R4.2 80.97,38.67 IC6.8
N$41
  Top 0.406: IC7.13 12.07,15 R5.2
O_LFSR1
  Top 0.406: IC1.12 33.07,54.36 45.72,54.36 46.74,53.34 46.74,47.24 45.26,45.77 45.26,41.96 44.7,41.4 IC5.6
O_LFSR2  (via drill 0.6)
  Top 0.406: IC3.4 95.07,43.94 v97.03,43.94 | IC5.9 48.36,41.66 45.97,41.66 45.72,41.4 45.72,37.08 45.97,36.83 v46.48,36.83
  Bottom 0.406: v46.48,36.83 48.26,35.05 96.27,35.05 98.3,37.08 98.3,43.69 98.04,43.94 v97.03,43.94
O_LSFR3  (via drill 0.6)
  Top 0.406: v91.95,53.09 IC3.11 | IC5.13 47.24,46.48 v46.84,46.08
  Bottom 0.406: v91.95,53.09 79.76,58.67 60.71,58.67 57.66,55.63 57.66,46.48 55.88,43.69 49.23,43.69 v46.84,46.08
OUTA4
  Top 0.406: IC7.8 12.63,21.35 11.89,22.1 11.89,26.06 OUTA3.1
Q0
  Top 0.406: IC1.22 25.91,42.8 28.45,40.26 IC1.1
Q1
  Top 0.406: IC1.2 28.42,41.53 25.88,44.07 IC1.21
Q2  (via drill 0.6)
  Top 0.406: IC5.1 v44.5,47.75 | IC1.20 26.26,45.34 28.8,42.8 IC1.3 33.07,42.67 34.16,42.67 34.42,42.42 v34.42,38.76
  Bottom 0.406: v44.5,47.75 45.11,46.94 45.11,36.98 44.96,36.83 35.81,36.83 34.42,38.23 v34.42,38.76
Q4
  Top 0.406: IC1.16 IC1.9
Q5
  Top 0.406: IC1.15 IC1.10
Q6
  Top 0.406: IC1.14 IC1.11 33.07,53.09 45.72,53.09 45.97,52.83 45.97,47.95 44.5,46.33 44.5,43.28 43.89,42.67 IC5.5
TT_A1
  Top 0.406: IC1.4 34.16,44.07 | 34.16,44.07 37.49,47.4 39.01,47.4 39.93,46.48 IC5.2 | 34.16,44.07 38.51,39.73 INA1.1
TT_A2  (via drill 0.6)
  Top 0.406: INA2.1 66.29,40.13 v66.04,42.93 | v60.45,44.45 60.48,44.22 IC4.4
  Bottom 0.406: v66.04,42.93 64.26,43.94 v60.45,44.45
TT_A3
  Top 0.406: IC4.12 63.09,54.36 INA3.1
TT_A4  (via drill 0.6)
  Top 0.406: v71.88,45.47 71.63,45.21 INA4.1 | v77.22,46.23 76.96,46.23 76.81,46.38 IC6.2 | IC4.3 63.04,42.93 v60.71,42.93
  Bottom 0.406: v71.88,45.47 72.64,46.23 v77.22,46.23 | v60.71,42.93 61.47,42.16 65.02,42.16 65.53,41.66 68.83,41.66 69.6,42.42 INA4.1
TT_V
  Top 0.406: INV.1 69.14,52.22 64.52,52.38 64.29,51.84 IC4.10
V1
  Top 0.254: NE_V.1 56.69,28.04 62.79,21.95 64.16,21.95 65.23,23.01 65.23,24.54 65.99,25.3 75.74,25.3 77.72,27.13 77.72,35.51 78.79,36.73 87.78,36.73 88.7,37.64 94.49,37.64 96.16,36.27 96.16,34.44 94.79,33.07 86.41,33.07 85.04,31.7 85.04,29.87 86.56,28.35 96.32,28.35 97.84,26.82 97.84,24.99 96.47,23.62 87.94,23.62 86.56,22.25 86.56,19.81 84.28,17.53 51.36,17.53 49.38,19.51 47.09,19.51 45.72,18.14 45.72,16 47.4,14.17 91.29,14.17 93.27,16.15 95.56,16.15 96.93,14.78 96.93,12.65 95.25,10.82 90.98,10.82 88.7,8.84 50.9,8.84 48.92,10.82 46.63,10.82 45.26,9.45 45.26,7.32 46.94,5.49 89.46,5.49 92.35,7.62 95.4,7.62 97.08,5.79 97.08,3.66 95.71,2.29 2.74,2.29 1.83,3.66 1.98,57.61 3.2,58.83 10.97,58.83 12.19,57.61 12.19,54.1 7.01,48.92 7.01,8.08 8.23,6.86 17.37,6.86 19.66,9.14 19.66,11.73 20.27,12.5 29.97,12.5 JPL1.1
  Top 0.406: VCC.2 58.93,34.7 NE_V.1
  Bottom 0.254: JPL0.1 JPL1.1 JPL2.1 JPL3.1
VCC  (via drill 0.33, 0.6)
  Top 0.406: CP5.1 CP4.1 CP3.1 CP2.1 | 31.75,72.9 31.75,74.68 30.99,75.44 23.47,75.44 21.45,77.45 RC1.2 | 31.75,72.9 31.75,69.09 31.09,69.09 | COUNTER.16 33.68,60.45 30.79,60.45 | 30.79,60.45 25.65,60.45 24.64,61.47 24.64,68.33 25.4,69.09 31.09,69.09 | COUNTER.11 33.93,72.9 31.75,72.9 | BUFFER.19 BUFFER.18 65.28,77.27 65.28,80.01 | U$1.1 31.09,68.96 31.09,69.09 | v79.96,39.04 77.06,38.35 75.89,37.19 75.89,34.27 v76,34.16 | v70.21,34.16 70.21,35.61 70.56,35.97 VCC.14 | IC7.14 15.56,13.73 16.15,14.33 16.15,45.57 v20.27,45.41 | C5.1 30.79,59.78 30.79,60.45
  Top 0.61: CP2.1 CP1.1 11.12,75.26 USBMINI.VBUS | CP4.1 JP7.2 | 83.57,79.76 83.82,80.01 | 92.02,79.93 91.95,80.01 | C4.1 73.46,78.83 73.46,80.01 | C1.1 12.02,13.73 IC7.14
  Top 0.813: RC1.2 19.81,80.01 | 25.65,60.45 20.73,55.52
  Top 1.27: CP1.1 13.74,79.53 14.22,80.01 19.81,80.01 65.28,80.01 73.46,80.01 83.82,80.01 91.95,80.01 94.49,78.74 97.54,75.69 98.3,53.85
  Bottom 0.406: v70.21,34.16 v76,34.16
  other vias: 39.57,51.38
  pour Top: 99.36,56.39 50.75,56.85 42.67,56.69 19.81,56.69 19.51,50.29 20.27,41.3 23.16,36.88 98.3,38.86 98.6,48.92
  pour Top (no thermals): 13.72,78.33 7.77,78.33 7.77,74.98 12.04,74.98 12.04,62.48 13.87,62.48 13.72,62.64

### Text on the board
tPlace: Inter Symbol Interference Experimentation Board | Portland State University & Intel Co. | Capstone Program 2015